# EAGLE design at89s52 (EAGLE 6.6.0)
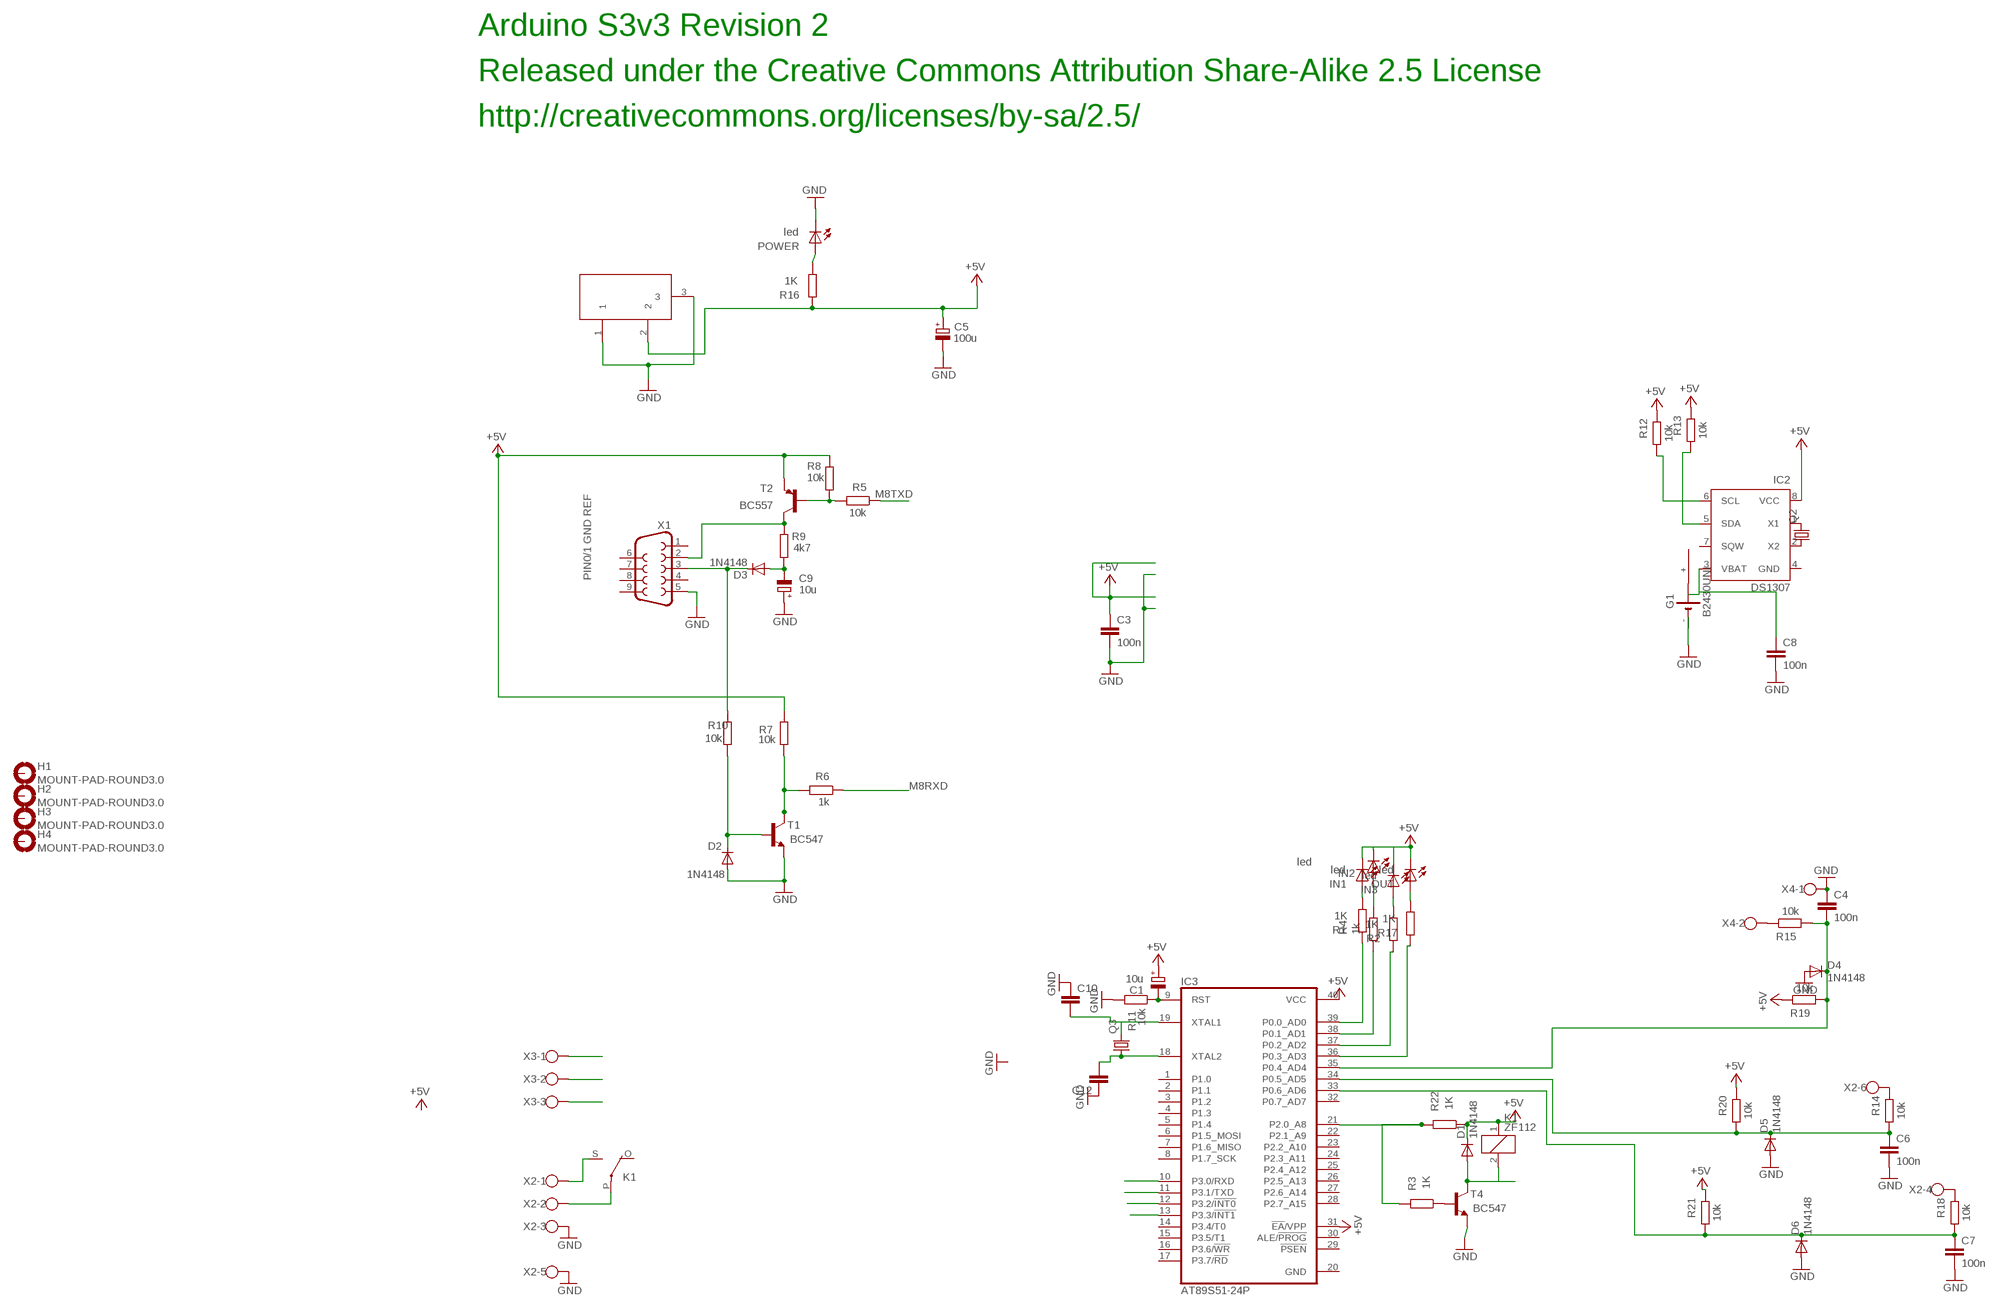
[diagram p0: schematic, sheet 1]

## Parts
C1  10u  CPOL-EUE5-6  [E5-6]
C3  100n  C-EU050-025X075  [C050-025X075]
C4  100n  C-EU050-025X075  [C050-025X075]
C5  100u  CPOL-EUE3.5-8  [E3,5-8]
C6  100n  C-EU050-025X075  [C050-025X075]
C7  100n  C-EU050-025X075  [C050-025X075]
C8  100n  C-EU050-025X075  [C050-025X075]
C9  10u  CPOL-EUE5-6  [E5-6]
C10  C-EU025-025X050  [C025-025X050]
C12  C-EU025-025X050  [C025-025X050]
D1  1N4148  [DO35-10]
D2  1N4148  [DO35-10]
D3  1N4148  [DO35-10]
D4  1N4148  [DO35-10]
D5  1N4148  [DO35-10]
D6  1N4148  [DO35-10]
DC1  DC21MMX  [DC-21MM]
G1  B2430UNI  [B2430UNI]
H1  MOUNT-PAD-ROUND3.0  [3,0-PAD]
H2  MOUNT-PAD-ROUND3.0  [3,0-PAD]
H3  MOUNT-PAD-ROUND3.0  [3,0-PAD]
H4  MOUNT-PAD-ROUND3.0  [3,0-PAD]
IC2  DS1307  [DIL08]
IC3  AT89S51-24P  [DIL40]
IN1  led  LED3MM  [LED3MM]
IN2  led  LED3MM  [LED3MM]
IN3  led  LED3MM  [LED3MM]
K1  ZF112  [ZF112]
OUT  led  LED3MM  [LED3MM]
POWER  led  LED3MM  [LED3MM]
Q2  CRYSTALTC26H  [TC26H]
Q3  CRYSTALHC49S  [HC49/S]
R1  1K  R-EU_0207/10  [0207/10]
R2  1K  R-EU_0207/10  [0207/10]
R3  1K  R-EU_0207/10  [0207/10]
R4  1k  R-EU_0207/10  [0207/10]
R5  10k  R-EU_0207/10  [0207/10]
R6  1k  R-EU_0207/10  [0207/10]
R7  10k  R-EU_0207/10  [0207/10]
R8  10k  R-EU_0207/10  [0207/10]
R9  4k7  R-EU_0207/10  [0207/10]
R10  10k  R-EU_0207/10  [0207/10]
R11  10k  R-EU_0207/10  [0207/10]
R12  10k  R-EU_0207/10  [0207/10]
R13  10k  R-EU_0207/10  [0207/10]
R14  10k  R-EU_0207/10  [0207/10]
R15  10k  R-EU_0207/10  [0207/10]
R16  1K  R-EU_0207/10  [0207/10]
R17  1K  R-EU_0207/10  [0207/10]
R18  10k  R-EU_0207/10  [0207/10]
R19  10k  R-EU_0207/10  [0207/10]
R20  10k  R-EU_0207/10  [0207/10]
R21  10k  R-EU_0207/10  [0207/10]
R22  1K  R-EU_0207/10  [0207/10]
T1  BC547  [TO92]
T2  BC557  BC557B-PNP-TO92-EBC  [TO92-EBC]
T4  BC547  [TO92]
X1  F09H  [F09H]
X2  W237-6  [W237-6]
X3  W237-103  [W237-103]
X4  W237-102  [W237-102]

## Nets
+5V [power]: C1.+ C3.1 C5.+ D1.C DC1.2 IC2.8(VCC) IC3.31(!EA!/VPP) IC3.40(VCC) IN1.K(C) IN2.K(C) IN3.K(C) K1.1 OUT.K(C) R7.2 R8.1 R12.1 R13.1 R16.2 R19.1 R20.1 R21.1 R22.1 T2.E
GND: C3.2 C4.1 C5.- C6.2 C7.2 C8.2 C9.+ C10.1 C12.1 D2.A D4.A D5.A D6.A DC1.1 DC1.3 G1.- G1.-@1(-) POWER.K(C) R11.2 T1.1(E) T4.1(E) X1.5 X2.3 X2.5 X3.2 X4.1
M8RXD: IC3.10(P3.0/RXD) R6.1
M8TXD: IC3.11(P3.1/TXD) R5.1
N$1: R3.1 T4.2(B)
N$2: C9.- D3.A R9.1
N$3: IN2.A R4.1
N$4: D1.A K1.2 T4.3(C)
N$5: R18.1 X2.4
N$6: C12.2 IC3.18(XTAL2) Q3.1
N$7: C10.2 IC3.19(XTAL1) Q3.2
N$8: K1.S(2:S) X2.1
N$9: K1.P(2:P) X2.2
N$12: C8.1 G1.+@4(+) IC2.3(VBAT)
N$13: C4.2 D4.C IC3.35(P0.4_AD4) R15.2 R19.2
N$14: C6.1 D5.C IC3.34(P0.5_AD5) R14.2 R20.2
N$15: R14.1 X2.6
N$16: IC3.39(P0.0_AD0) R1.2
N$17: IC3.38(P0.1_AD1) R4.2
N$18: IC3.37(P0.2_AD2) R2.2
N$19: POWER.A R16.1
N$20: C7.1 D6.C IC3.33(P0.6_AD6) R18.2 R21.2
N$21: OUT.A R17.1
N$22: IC3.36(P0.3_AD3) R17.2
N$23: R15.1 X4.2
N$24: IC2.1(X1) Q2.2
N$25: IC2.2(X2) Q2.1
N$26: R6.2 R7.1 T1.3(C)
N$27: R5.2 R8.2 T2.B
N$28: C1.- IC3.9(RST) R11.1
N$29: D2.C R10.1 T1.2(B)
N$32: IN3.A R2.1
N$33: IN1.A R1.1
RLY: IC3.21(P2.0_A8) R3.2 R22.2
RX: D3.C R10.2 X1.3 X3.3
SCL: IC2.6(SCL) IC3.13(P3.3/!INT1) R12.2
SDA: IC2.5(SDA) IC3.12(P3.2/!INT0) R13.2
TX: R9.2 T2.C X1.2 X3.1
Unconnected: G1.+ G1.+@1(+) G1.+@2(+) G1.+@3(+) H1.B3,0(MOUNT) H2.B3,0(MOUNT) H3.B3,0(MOUNT) H4.B3,0(MOUNT) IC2.7(SQW) IC3.1(P1.0) IC3.2(P1.1) IC3.3(P1.2) IC3.4(P1.3) IC3.5(P1.4) IC3.6(P1.5_MOSI) IC3.7(P1.6_MISO) IC3.8(P1.7_SCK) IC3.14(P3.4/T0) IC3.15(P3.5/T1) IC3.16(P3.6/!WR) IC3.17(P3.7/!RD) IC3.22(P2.1_A9) IC3.23(P2.2_A10) IC3.24(P2.3_A11) IC3.25(P2.4_A12) IC3.26(P2.5_A13) IC3.27(P2.6_A14) IC3.28(P2.7_A15) IC3.29(!PSEN) IC3.30(ALE/!PROG) IC3.32(P0.7_AD7) K1.O(2:O) X1.1 X1.4 X1.6 X1.7 X1.8 X1.9

## Notes on the sheet
- Arduino S3v3 Revision 2
- Released under the Creative Commons Attribution Share-Alike 2.5 License
- http://creativecommons.org/licenses/by-sa/2.5/
- PIN0/1 GND REF

## Power pins joined to a net without a drawn wire
GND: IC2.4(GND) IC3.20(GND)

## Library data of the parts
C1 C5 C9 = rcl:CPOL-EU: POLARIZED CAPACITOR, European symbol
C3 C4 C6-C8 C10 C12 = rcl:C-EU: CAPACITOR, European symbol
D1-D6 = diode:1N4148: DIODE high speed (Philips)
DC1 = powersupply:DC21MM
G1 = battery:B2430UNI: LI BATTERY
H1-H4 = holes:MOUNT-PAD-ROUND: MOUNTING PAD, round
IC2 = ds1307_pcf8583:DS1307: I2C-Bus CLOCK/CALENDAR
IC3 = atmel:AT89S51-*: 8-bit Microcontroller with 4K BytesIn-System Programmable Flash Source: http://www.atmel.com/dyn/resources/prod_documents/doc2487.pdf; MPN: AT89S51-24PU; OC_FARNELL: 1095739; OC_NEWARK: 96K6578
IN1-IN3 OUT POWER = led:LED: LED OSRAM: - CHIPLED LG R971, LG N971, LY N971, LG Q971, LY Q971, LO R971, LY R971 LH N974, LH R974 LS Q976, LO Q976, LY Q976 LO Q996 - Hyper CHIPLED LW Q18S LB Q993, LB Q99A, LB R99A - SideLED LS A670, LO A670, LY A670, LG A670, LP A670 LB A673, LV A673, LT A673, LW A673 LH A674 LY A675 LS A676, LA A676, LO A676, LY A676, LW A676 LS A679, LY A679, LG A679 - Hyper Micro SIDELED® LS Y876, LA Y876, LO Y876, LY Y876 LT Y87S - SmartLED LW L88C, LW L88S LB L89C, LB L89S, LG L890 LS L89K, LO L89K, LY L89K LS L896, LA L896, LO L896, LY L896 - TOPLED LS T670, LO T670, LY T670, LG T670, LP T670 LSG T670, LSP T670, LSY T670, LOP T670, LYG T670 LG T671, LOG T671, LSG T671 LB T673, LV T673, LT T673, LW T673 LH T674 LS T676, LA T676, LO T676, LY T676, LB T676, LH T676, LSB T676, LW T676 LB T67C, LV T67C, LT T67C, LS T67K, LO T67K, LY T67K, LW E67C LS E67B, LA E67B, LO E67B, LY E67B, LB E67C, LV E67C, LT E67C LW T67C LS T679, LY T679, LG T679 LS T770, LO T770, LY T770, LG T770, LP T770 LB T773, LV T773, LT T773, LW T773 LH T774 LS E675, LA E675, LY E675, LS T675 LS T776, LA T776, LO T776, LY T776, LB T776 LHGB T686 LT T68C, LB T68C - Hyper Mini TOPLED® LB M676 - Mini TOPLED Santana® LG M470 LS M47K, LO M47K, LY M47K Source: http://www.osram.convergy.de/
K1 = relay:ZF112: RELAY 1 x switch; OC_FARNELL: unknown; OC_NEWARK: unknown
Q2 = crystal:CRYSTAL: CRYSTAL; OC_FARNELL: unknown; OC_NEWARK: unknown
Q3 = crystal:CRYSTAL: CRYSTAL; OC_FARNELL: 1667008; OC_NEWARK: unknown
R1-R22 = rcl:R-EU_: RESISTOR, European symbol
T1 T4 = transistor:BC547: NPN TRANSISTOR
T2 = transistor:*-PNP-: PNP Transistror
X1 = con-subd:F09: SUB-D
X2 = con-wago-500:W237-6: WAGO SCREW CLAMP; OC_FARNELL: unknown; OC_NEWARK: unknown
X3 = con-wago-500:W237-103: WAGO SCREW CLAMP; MPN: 237-103; OC_FARNELL: unknown; OC_NEWARK: 18M7116
X4 = con-wago-500:W237-102: WAGO SCREW CLAMP; MPN: 237-102; OC_FARNELL: unknown; OC_NEWARK: 70K9898

## Net classes
1 power: width 0.61 mm

## Board
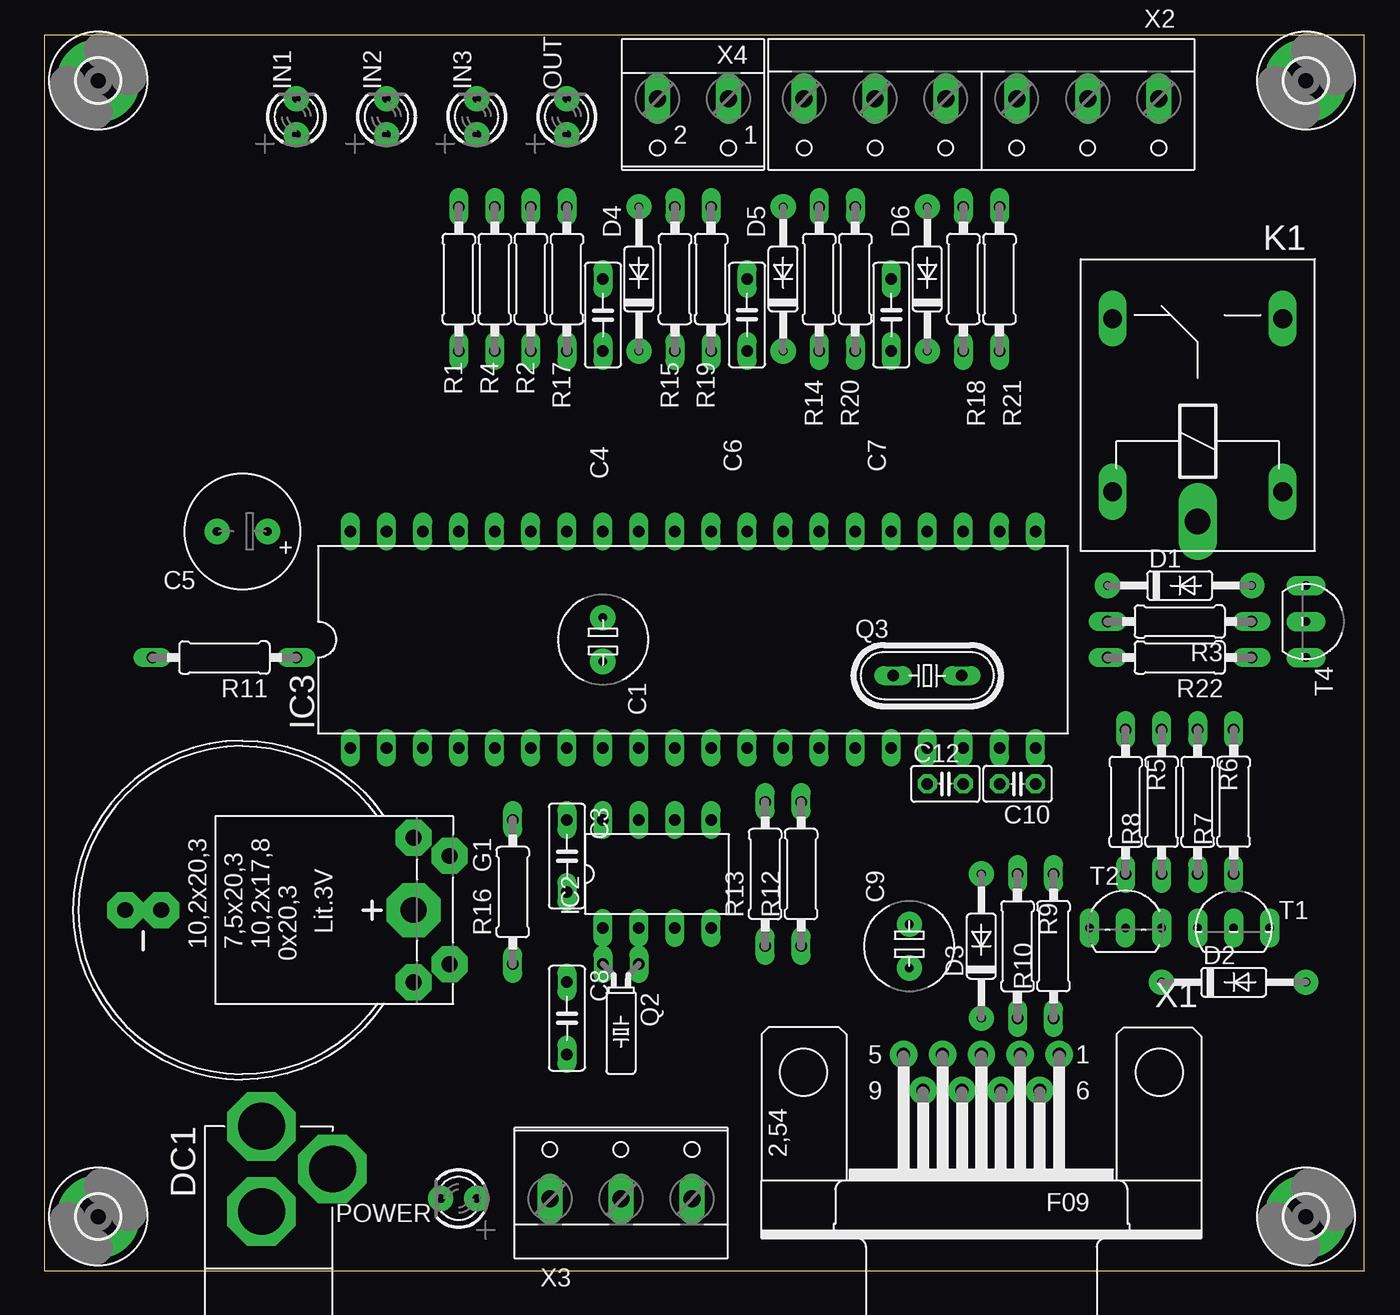
[diagram p1: board, top side]
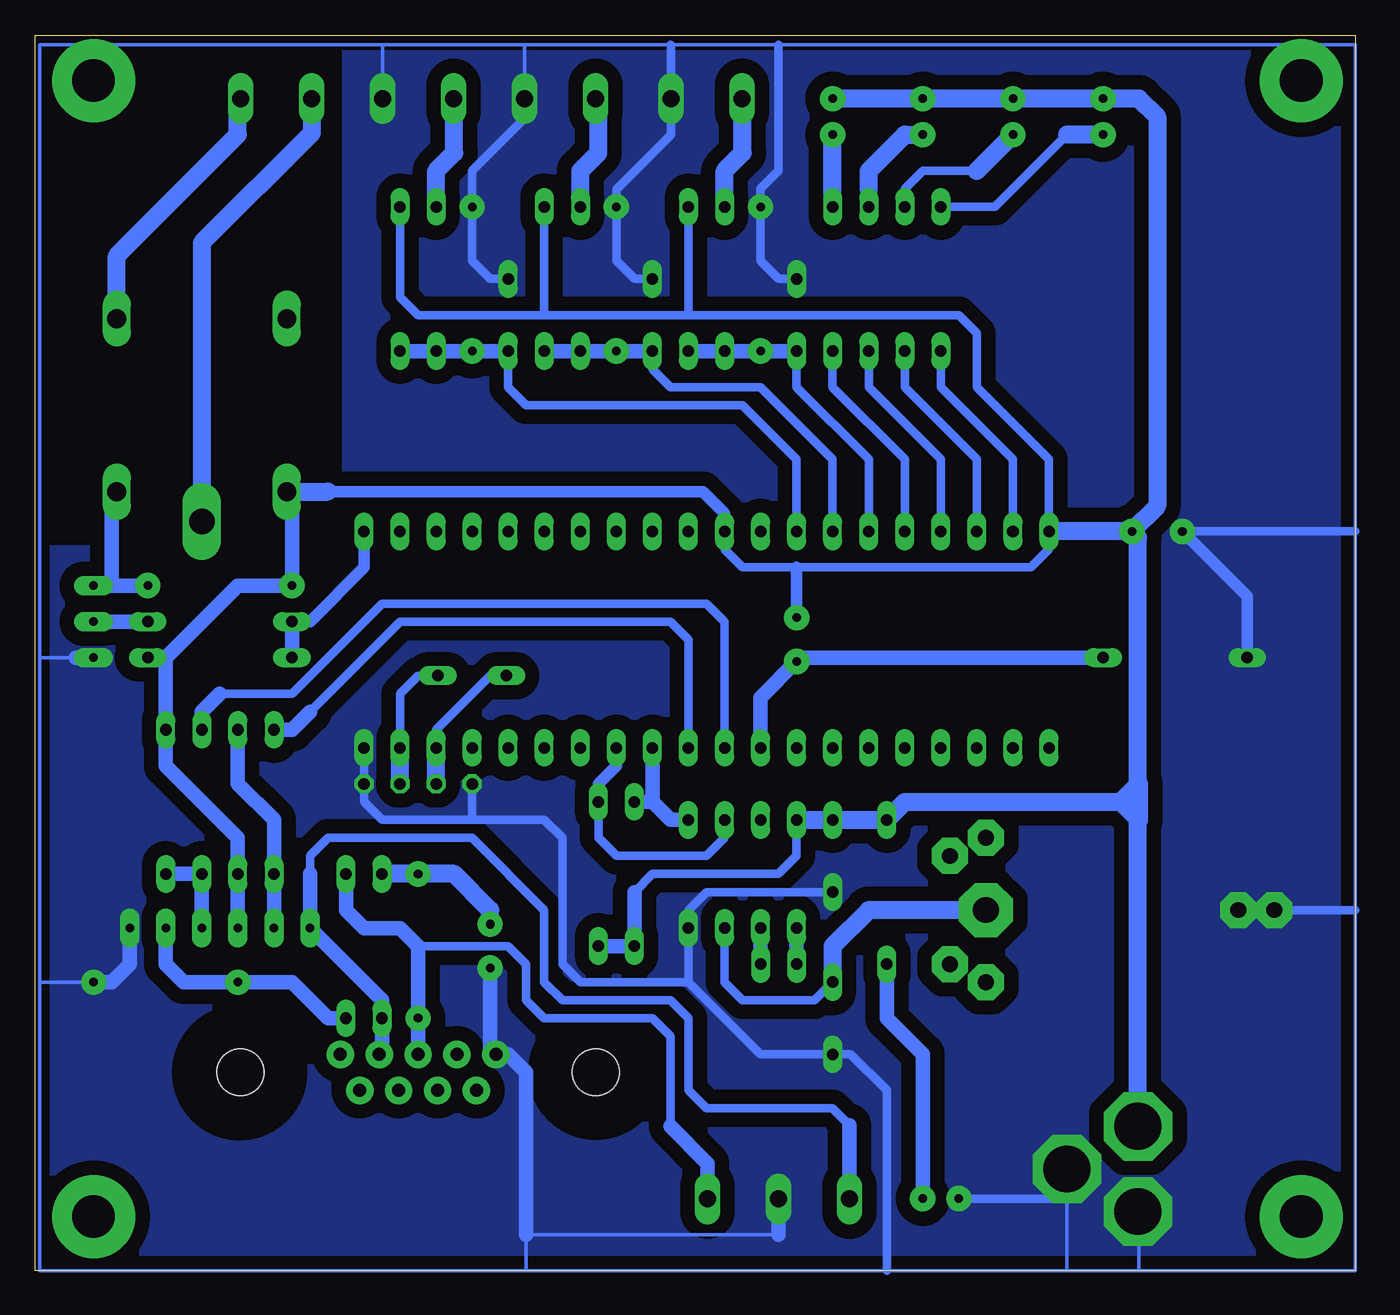
[diagram p2: board, bottom side, seen from below]

Size 93 x 87 mm. Coordinates in mm from the lower left corner, seen from the top.
Outline: 0,0 93,0 93,87 0,87 0,0
Copper layers (1*16): Top 0.035mm / dielectric 1.5mm / Bottom 0.035mm
Design rules "default": minimum track width 10mil, minimum drill 24mil, track to track 8mil, track to pad 8mil, pad to pad 8mil, via to via 8mil, smd to smd 8mil, copper to edge 40mil, drill to drill 8mil, minimum pad ring 10mil, minimum via ring 8mil, stop-mask expansion 4mil, vias tented up to drill 0mil, thermal gap 10mil

### Footprints (pad centres in the part's own frame; a part is rotated, then mirrored left to right if it is on the bottom)
E5-6 = drill 0.6 pad 1.778: + -1.54,0; - 1.54,0
C050-025X075 = drill 0.813 long: 1 -2.54,0; 2 2.54,0
E3,5-8 = drill 0.6 pad 1.778: + -1.778,0; - 1.778,0
C025-025X050 = drill 0.813 octagon: 1 -1.27,0; 2 1.27,0
DO35-10 = drill 0.6 pad 1.778: A 5.08,0; C -5.08,0
DC-21MM = drill 3.302 pad 4.826 octagon: 1 -5.08,-3.353; 2 -0.076,-6.35; 3 -0.076,-0.356
B2430UNI = drill 1.118 pad 2.54 octagon: + 3.81,14.605; +@1 -3.81,14.605; +@2 -5.08,12.065; +@3 5.08,12.065; - 0,-5.715; -@1 0,-8.255 | drill 1.803 pad 3.81 octagon: +@4 0,12.065
3,0-PAD = drill 3 pad 5.842: B3,0 0,0
DIL08 = drill 0.813 long: 1 -3.81,-3.81; 2 -1.27,-3.81; 3 1.27,-3.81; 4 3.81,-3.81; 5 3.81,3.81; 6 1.27,3.81; 7 -1.27,3.81; 8 -3.81,3.81
DIL40 = drill 0.813 long: 1 -24.13,-7.62; 2 -21.59,-7.62; 3 -19.05,-7.62; 4 -16.51,-7.62; 5 -13.97,-7.62; 6 -11.43,-7.62; 7 -8.89,-7.62; 8 -6.35,-7.62; 9 -3.81,-7.62; 10 -1.27,-7.62; 11 1.27,-7.62; 12 3.81,-7.62; 13 6.35,-7.62; 14 8.89,-7.62; 15 11.43,-7.62; 16 13.97,-7.62; 17 16.51,-7.62; 18 19.05,-7.62; 19 21.59,-7.62; 20 24.13,-7.62; 21 24.13,7.62; 22 21.59,7.62; 23 19.05,7.62; 24 16.51,7.62; 25 13.97,7.62; 26 11.43,7.62; 27 8.89,7.62; 28 6.35,7.62; 29 3.81,7.62; 30 1.27,7.62; 31 -1.27,7.62; 32 -3.81,7.62; 33 -6.35,7.62; 34 -8.89,7.62; 35 -11.43,7.62; 36 -13.97,7.62; 37 -16.51,7.62; 38 -19.05,7.62; 39 -21.59,7.62; 40 -24.13,7.62
LED3MM = drill 0.6 pad 1.778: A -1.27,0; K 1.27,0
ZF112 = drill 1.321 long: 1 -6.096,5.994; 2 -6.096,-5.994; O 6.096,5.994; S 6.096,-5.994 | drill 1.803 long: P -8.204,0
TC26H = drill 0.813 long: 1 -1.27,0; 2 1.27,0
HC49/S = drill 0.813 long: 1 -2.413,0; 2 2.413,0
0207/10 = drill 0.813 long: 1 -5.08,0; 2 5.08,0
TO92 = drill 0.6 pad 1.372 long: 1 2.54,0; 2 0,0; 3 -2.54,0
TO92-EBC = drill 0.6 pad 1.372 long: B 0,-1.27; C -2.54,-1.27; E 2.54,-1.27
F09H = drill 0.9 pad 1.93: 1 -5.486,-1.27; 2 -2.743,-1.27; 3 0,-1.27; 4 2.743,-1.27; 5 5.486,-1.27; 6 -4.115,1.27; 7 -1.372,1.27; 8 1.372,1.27; 9 4.115,1.27 | hole 3.302: -12.522,0; 12.522,0
W237-6 = drill 1.194 long: 1 -12.5,-1.27; 2 -7.5,-1.27; 3 -2.5,-1.27; 4 2.5,-1.27; 5 7.5,-1.27; 6 12.5,-1.27
W237-103 = drill 1.194 long: 1 -5,-1.29; 2 0,-1.29; 3 5,-1.29
W237-102 = drill 1.194 long: 1 -2.5,-1.27; 2 2.5,-1.27

### Placement (x,y rotation side)
C1  39.37,44.45 270 top
C3  36.83,29.21 270 top
C4  39.37,67.31 270 top
C5  13.97,52.07 180 top
C6  49.53,67.31 90 top
C7  59.69,67.31 90 top
C8  36.83,17.78 270 top
C9  60.96,22.86 90 top
C10  68.58,34.29 180 top
C12  63.5,34.29 0 top
D1  80.01,48.26 0 top
D2  83.82,20.32 0 top
D3  66.04,22.86 90 top
D4  41.91,69.85 90 top
D5  52.07,69.85 90 top
D6  62.23,69.85 90 top
DC1  15.24,3.81 180 top
G1  13.97,25.4 270 top
H1  88.9,3.81 0 top
H2  88.9,83.82 0 top
H3  3.81,83.82 0 top
H4  3.81,3.81 0 top
IC2  43.18,27.94 0 top
IC3  45.72,44.45 0 top
IN1  17.78,81.28 90 top
IN2  24.13,81.28 90 top
IN3  30.48,81.28 90 top
K1  81.28,60.96 90 top
OUT  36.83,81.28 90 top
POWER  29.21,5.08 180 top
Q2  40.64,21.59 180 top
Q3  62.23,41.91 0 top
R1  29.21,69.85 270 top
R2  34.29,69.85 270 top
R3  80.01,45.72 180 top
R4  31.75,69.85 270 top
R5  76.2,33.02 270 top
R6  81.28,33.02 270 top
R7  83.82,33.02 90 top
R8  78.74,33.02 90 top
R9  68.58,22.86 270 top
R10  71.12,22.86 90 top
R11  12.7,43.18 180 top
R12  53.34,27.94 90 top
R13  50.8,27.94 90 top
R14  54.61,69.85 270 top
R15  44.45,69.85 270 top
R16  33.02,26.67 90 top
R17  36.83,69.85 270 top
R18  64.77,69.85 270 top
R19  46.99,69.85 270 top
R20  57.15,69.85 270 top
R21  67.31,69.85 270 top
R22  80.01,43.18 180 top
T1  83.82,24.13 0 top
T2  76.2,25.4 0 top
T4  88.9,45.72 270 top
X1  66.04,13.97 180 top
X2  66.04,81.28 180 top
X3  40.64,6.35 0 top
X4  45.72,81.28 180 top

### Tracks (layer width: path | path; a pad name or v marks a point on that pad's centre or on a via)
+5V
  Bottom 0.61: 50.8,26.67 49.53,27.94 40.64,27.94 39.37,29.21 IC2.8 | 46.99,68.58 R19.1 46.99,67.31 | 57.15,67.31 66.04,67.31 67.31,68.58 R21.1 | R20.1 57.15,67.31 | IC3.31 44.45,50.8 43.18,49.53 39.37,49.53 22.86,49.53 21.59,50.8 IC3.40 21.59,57.15 26.67,62.23 26.67,66.04 27.94,67.31 46.99,67.31 | 15.32,51.64 C5.+ | 57.15,67.31 46.99,67.31
  Bottom 0.813: 74.93,54.86 72.39,54.86 45.97,54.86 44.45,53.34 IC3.31 | C1.+ 39.37,49.53
  Bottom 1.016: 74.93,54.86 D1.C 78.74,48.26 83.82,43.18 | T2.E R8.1 78.74,30.48 83.82,35.56 R7.2 83.82,43.18 | R22.1 83.82,43.18 | R12.1 R13.1 50.8,26.67
  Bottom 1.27: IC2.8 C3.1 R16.2 31.75,33.02 16.51,33.02 | IC3.40 C5.+ 13.97,53.85 13.97,81.28 15.24,82.55 IN1.K IN2.K IN3.K OUT.K | DC1.2 15.32,33.02 | 15.32,33.02 15.32,51.64 | 15.32,33.02 16.51,33.02 | 16.51,33.02 15.24,34.29 15.24,31.75 16.51,33.02 | K1.1 72.39,54.86
GND
  Bottom 0.254: DC1.3 15.24,4.17 15.24,0 | 15.24,0 20.32,0 | 20.32,0 33.02,0 58.42,0 | 58.42,0 92.71,0 92.71,20.32 | 92.71,20.32 92.71,43.18 | 92.71,43.18 92.71,86.36 68.58,86.36 | 68.58,86.36 58.42,86.36 | 58.42,86.36 48.26,86.36 40.64,86.36 0,86.36 0,52.07 0,25.4 0,0 15.24,0 | DC1.1 20.32,5.08 20.32,0 | D2.A 92.71,20.32 | 90.17,43.18 92.71,43.18 | X2.5 58.54,86.24 58.42,86.36 | X2.3 68.54,86.32 68.58,86.36 | 40.64,2.54 58.42,2.54 58.42,0
  Bottom 0.61: G1.-@1 G1.- 0,25.4 | POWER.K 20.32,5.08 | 48.26,86.36 48.22,86.32 X4.1 48.22,80.01 52.07,76.16 D5.A 52.07,71.12 50.8,69.85 C6.2 | C7.2 60.96,69.85 62.23,71.12 D6.A 62.23,77.47 58.42,81.28 58.42,82.43 X2.5 | C4.1 40.64,69.85 41.91,71.12 D4.A 41.91,76.2 40.64,77.47 40.64,86.36 | 46.99,20.32 IC2.4 46.99,25.4 45.72,26.67 C3.2 | 46.99,20.32 41.91,15.24 35.56,15.24 33.02,12.7 33.02,0 | C5.- 0,52.07 | IC3.20 C10.1 69.85,33.02 68.58,31.75 62.23,31.75 | 46.99,20.32 54.61,20.32 55.88,21.59 55.88,30.48 57.15,31.75 62.23,31.75 | C12.1 62.23,31.75
  Bottom 0.813: R11.2 7.62,47.5 C5.-
  Bottom 1.016: T1.1 86.36,21.59 87.63,20.32 D2.A | 58.42,2.54 58.42,13.97 59.69,15.24 X1.5 60.96,15.65 C9.+ | X3.2 40.64,2.54 | T4.1 90.17,43.18 | 49.65,69.97 C6.2 | 13.97,3.81 14.96,3.81 DC1.3
  pour Bottom (isolate 1.016, no thermals): -1.27,88.9 -1.27,-1.27 93.98,-1.27 93.98,50.8 73.66,50.8 71.12,53.34 71.12,88.9
M8RXD
  Bottom 0.61: IC3.10 44.45,45.72 45.72,46.99 68.58,46.99 74.93,40.64 80.01,40.64
  Bottom 1.016: R6.1 81.28,39.37 80.01,40.64
M8TXD
  Bottom 0.61: IC3.11 46.99,44.45 48.26,45.72 67.31,45.72 73.66,39.37
  Bottom 1.016: R5.1 74.93,38.1 73.66,39.37
N$1
  Bottom 1.016: T4.2 R3.1
N$2
  Bottom 1.27: C9.- 60.96,25.4 63.5,27.94 D3.A R9.1
N$3
  Bottom 0.61: R4.1 31.75,76.2 30.48,77.47 26.67,77.47
  Bottom 1.27: 26.67,77.47 IN2.A
N$4
  Bottom 1.016: K1.2 87.63,54.86 87.63,48.26 T4.3 D1.A
N$5
  Bottom 1.27: R18.1 64.77,77.47 63.5,78.74 63.5,82.51 X2.4
N$6
  Bottom 0.61: IC3.18 64.77,38.1 60.96,41.91 Q3.1
  Bottom 1.27: C12.2 IC3.18
N$7
  Bottom 0.61: IC3.19 67.31,40.64 66.04,41.91 Q3.2
  Bottom 1.27: C10.2 IC3.19
N$8
  Bottom 1.27: K1.S 87.27,71.48 78.74,80.01 78.74,82.35 X2.1
N$9
  Bottom 1.27: X2.2 73.54,80.13 81.28,72.39 K1.P
N$12
  Bottom 0.61: IC2.3 44.45,20.32 43.18,19.05 38.1,19.05 C8.1
  Bottom 1.27: G1.+@4 34.29,25.4 36.83,22.86 C8.1
N$13
  Bottom 0.61: IC3.35 34.29,57.15 39.37,62.23 C4.2
  Bottom 1.016: C4.2 R15.2 D4.C R19.2
N$14
  Bottom 0.61: IC3.34 36.83,57.15 41.91,62.23 48.26,62.23 49.53,63.5 C6.1
  Bottom 1.016: C6.1 D5.C R14.2 R20.2
N$15
  Bottom 1.27: R14.1 54.61,77.47 53.34,78.74 53.34,82.35 X2.6
N$16
  Bottom 0.61: IC3.39 24.13,57.15 29.21,62.23 R1.2
N$17
  Bottom 0.61: IC3.38 26.67,57.15 31.75,62.23 R4.2
N$18
  Bottom 0.61: IC3.37 29.21,57.15 34.29,62.23 R2.2
N$19
  Bottom 1.016: R16.1 33.02,17.78 30.48,15.24 POWER.A
N$20
  Bottom 0.61: IC3.33 39.37,57.15 43.18,60.96 58.42,60.96 59.69,62.23 C7.1
  Bottom 1.016: C7.1 D6.C R18.2 R21.2
N$21
  Bottom 1.27: R17.1 OUT.A
N$22
  Bottom 0.61: IC3.36 31.75,57.15 36.83,62.23 R17.2
N$23
  Bottom 1.27: R15.1 44.45,77.47 43.18,78.74 43.18,82.51 X4.2
N$24
  Bottom 1.016: IC2.1 Q2.2
N$25
  Bottom 1.016: IC2.2 Q2.1
N$26
  Bottom 1.016: T1.3 R6.2 R7.1
N$27
  Bottom 1.016: T2.B R5.2 76.2,31.75 78.74,34.29 R8.2
N$28
  Bottom 1.016: R11.1 39.1,43.18 C1.- 41.91,40.37 IC3.9
N$29
  Bottom 1.016: T1.2 83.82,21.59 82.55,20.32 D2.C 74.93,20.32 72.39,17.78 R10.1
N$32
  Bottom 0.61: R2.1 34.29,76.2
  Bottom 1.27: 34.29,76.2 34.29,77.47 31.75,80.01 IN3.A
N$33
  Bottom 0.61: R1.1 25.4,74.93 20.32,80.01
  Bottom 1.27: IN1.A 20.32,80.01
RLY
  Bottom 0.813: IC3.21 69.85,49.53 73.66,45.72 R3.2
  Bottom 1.016: R22.2 R3.2
RX
  Bottom 0.61: 48.26,10.16 48.26,16.51 49.53,17.78 57.15,17.78 58.42,19.05 58.42,21.59 59.69,22.86 66.04,22.86
  Bottom 1.016: R10.2 71.12,25.4 69.85,24.13 67.31,24.13 66.04,22.86 D3.C X1.3 | X3.3 45.64,7.54 48.26,10.16
SCL
  Bottom 0.61: R12.2 53.34,30.48 52.07,29.21 45.72,29.21 44.45,30.48 IC2.6
  Bottom 0.813: IC3.13 52.07,35.56 53.34,34.29 R12.2
SDA
  Bottom 1.016: IC2.5 48.26,31.75 49.53,33.02 | 49.53,33.02 IC3.12 | R13.2 49.53,33.02
TX
  Bottom 0.61: 35.64,10.24 36.83,11.43 45.72,11.43 46.99,12.7 46.99,17.78 48.26,19.05 55.88,19.05 57.15,20.32 57.15,25.4 62.23,30.48 72.39,30.48 73.66,29.21 73.66,27.94
  Bottom 1.016: 68.58,15.24 X1.2 68.58,15.44 R9.2 68.58,19.05 T2.C 73.66,27.94 | X3.1 35.64,10.24